# EAGLE schematic untitled (EAGLE 6.5.0)

## Sheet 1 of 3
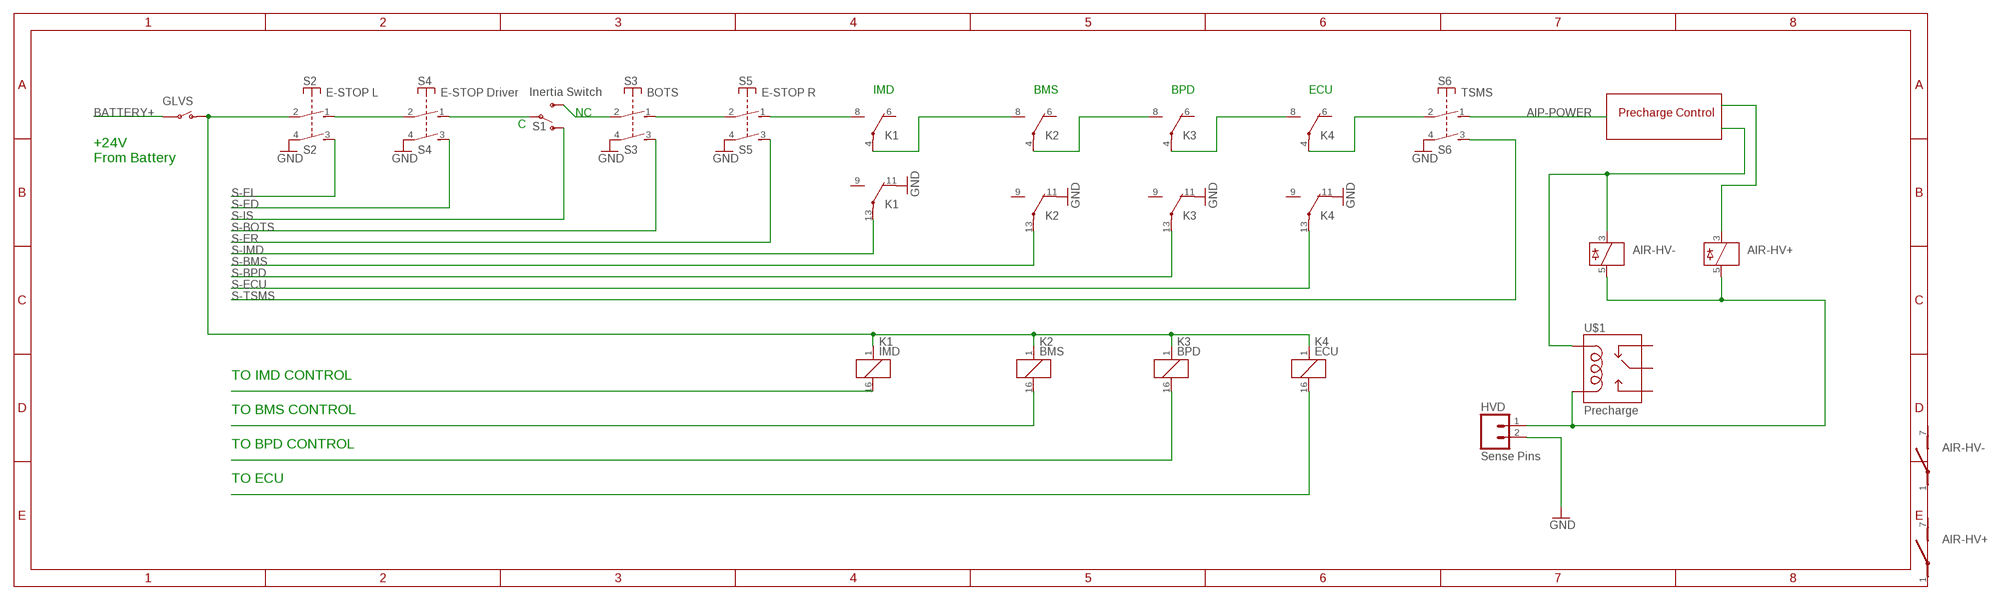
[diagram p0: schematic, sheet 1]

### Parts
AIR-HV+  35701331  [REED]
AIR-HV-  35701331  [REED]
GLVS  SWITCH-SPST-2TV  [SWITCH-SPST-VERTICAL]
HVD  Sense Pins  M02-JST-2MM-SMT  [JST-2-SMD]
K1  IMD  BT-6-S  [BT-XX-S]
K2  BMS  BT-6-S  [BT-XX-S]
K3  BPD  BT-6-S  [BT-XX-S]
K4  ECU  BT-6-S  [BT-XX-S]
S1  Inertia Switch  SWITCH-SPDTPTH2  [SWITCHE-DPDT]
S2  E-STOP L  PVA1  [PVA1F]
S3  BOTS  PVA1  [PVA1F]
S4  E-STOP Driver  PVA1  [PVA1F]
S5  E-STOP R  PVA1  [PVA1F]
S6  TSMS  PVA1  [PVA1F]
U$1  Precharge  RELAYPTH  [RELAY-G5Q]

### Nets
+24V: GLVS.1(O) K1.1 K2.1 K3.1 K4.1 S2.2(1:P)
AIP-POWER: S6.1(1:S)
BATTERY+: GLVS.2(P)
GND: HVD.2 K1.11(-2:O) K2.11(-2:O) K3.11(-2:O) K4.11(-2:O) S2.4(2:P) S3.4(2:P) S4.4(2:P) S5.4(2:P) S6.4(2:P) ; also sheet 2
N$2: S2.1(1:S) S4.2(1:P)
N$3: S1.2(P) S4.1(1:S)
N$4: S1.3(S) S3.2(1:P)
N$5: S3.1(1:S) S5.2(1:P)
N$6: K4.4(-1:P) S6.2(1:P)
N$7: K1.16
N$10: K2.16
N$11: K3.16
N$12: K1.8(-1:S) S5.1(1:S)
N$13: K1.4(-1:P) K2.8(-1:S)
N$14: K2.4(-1:P) K3.8(-1:S)
N$15: K4.16
N$16: AIR-HV+.3
N$17: K3.4(-1:P) K4.8(-1:S)
N$18: AIR-HV-.3 U$1.5(COIL1)
N$19: AIR-HV+.5 AIR-HV-.5 HVD.1 U$1.1(COIL2)
S-BMS: K2.13(-2:P)
S-BOTS: S3.3(2:S)
S-BPD: K3.13(-2:P)
S-ECU: K4.13(-2:P)
S-ED: S4.3(2:S)
S-EL: S2.3(2:S)
S-ER: S5.3(2:S)
S-IMD: K1.13(-2:P)
S-IS: S1.1(O)
S-TSMS: S6.3(2:S)
Unconnected: AIR-HV+.1(2:P) AIR-HV+.7(2:S) AIR-HV-.1(2:P) AIR-HV-.7(2:S) K1.6(-1:O) K1.9(-2:S) K2.6(-1:O) K2.9(-2:S) K3.6(-1:O) K3.9(-2:S) K4.6(-1:O) K4.9(-2:S) U$1.2(MAIN) U$1.3(NO) U$1.4(NC)

### Notes on the sheet
- IMD | BMS | BPD | ECU
- NC | Precharge Control
- C
- +24V
  From Battery
- TO IMD CONTROL
- TO BMS CONTROL
- TO BPD CONTROL
- TO ECU

## Sheet 2 of 3
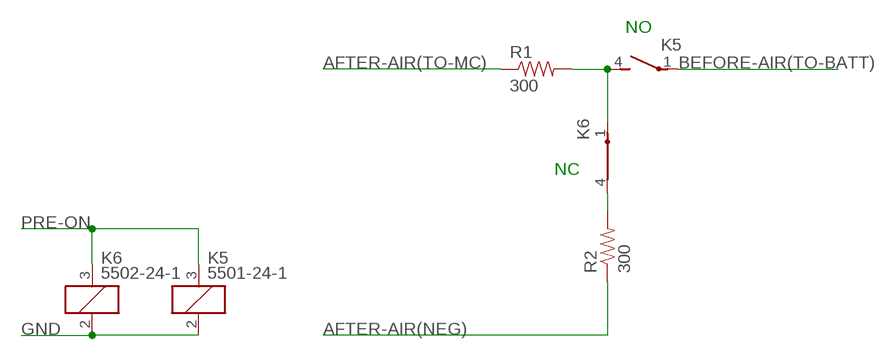
[diagram p1: schematic, sheet 2]

### Parts
K5  5501-24-1  [5500]
K6  5502-24-1  [5500]
R1  300  1MOHM1/10W1%(0603)  [0603-RES]
R2  300  1MOHM1/10W1%(0603)  [0603-RES]

### Nets
AFTER-AIR(NEG): R2.1
AFTER-AIR(TO-MC): R1.1
BEFORE-AIR(TO-BATT): K5.1(P)
GND: K5.2(-) K6.2(-) ; also sheet 1
N$8: K5.4(S) K6.1(P) R1.2
N$9: K6.4(S) R2.2
PRE-ON: K5.3(+) K6.3(+)

### Notes on the sheet
- NO
- NC

## Sheet 3 of 3

## Library data of the parts
AIR-HV+ AIR-HV- = relay:35701331: RELAY reed, 1 x norm. open with polarity; OC_FARNELL: unknown; OC_NEWARK: unknown
GLVS = SparkFun-Electromechanical:SWITCH-SPST-2
HVD = SparkFun-Connectors:M02: Standard 2-pin 0.1" header. Use with - straight break away headers ( PRT-00116) - right angle break away headers (PRT-00553) - swiss pins (PRT-00743) - machine pins (PRT-00117) - female headers (PRT-00115) Molex polarized connector foot print use with: PRT-08233 with associated crimp pins and housings. 2.54_SCREWTERM for use with PRT-10571. 3.5mm Screw Terminal footprints for PRT-08084 5mm Screw Terminal footprints for use with PRT-08432; PROD_ID: CONN-08352
K1-K4 = relay:BT-*-S: KLEIN RELAIS WASCHDICHT 2 Wechsler Distriibutor: Conrad Electronic, Bestell Nr.: 505226-13 - 24V 505226-13 - 5V 505170-13 - 12V 505170-13 - 48V Bestar Electric Ltd. Source: http://www2.produktinfo.conrad.com/datenblaetter/500000-524999/505226-da-01-en-Kleinrelais_waschdicht_24V.pdf; OC_FARNELL: unknown; OC_NEWARK: unknown
K5 = FSAE Eletric:5501-24-1
K6 = FSAE Eletric:5502-24-1
R1 R2 = SparkFun-Resistors:1MOHM1/10W1%(0603): RES-07868; PROD_ID: RES-07868
S1 = SparkFun-Electromechanical:SWITCH-SPDT: SPDT Switch Simple slide switch, Spark Fun Electronics SKU : COM-00102 DPDT SMT slide switch, AYZ0202, SWCH-08179
S2-S6 = switch-misc:PVA1: ITT SWITCH
U$1 = SparkFun-Electromechanical:RELAY: SPDT relay (COM-00101)